# EAGLE design 2_power_a (EAGLE 6.4)
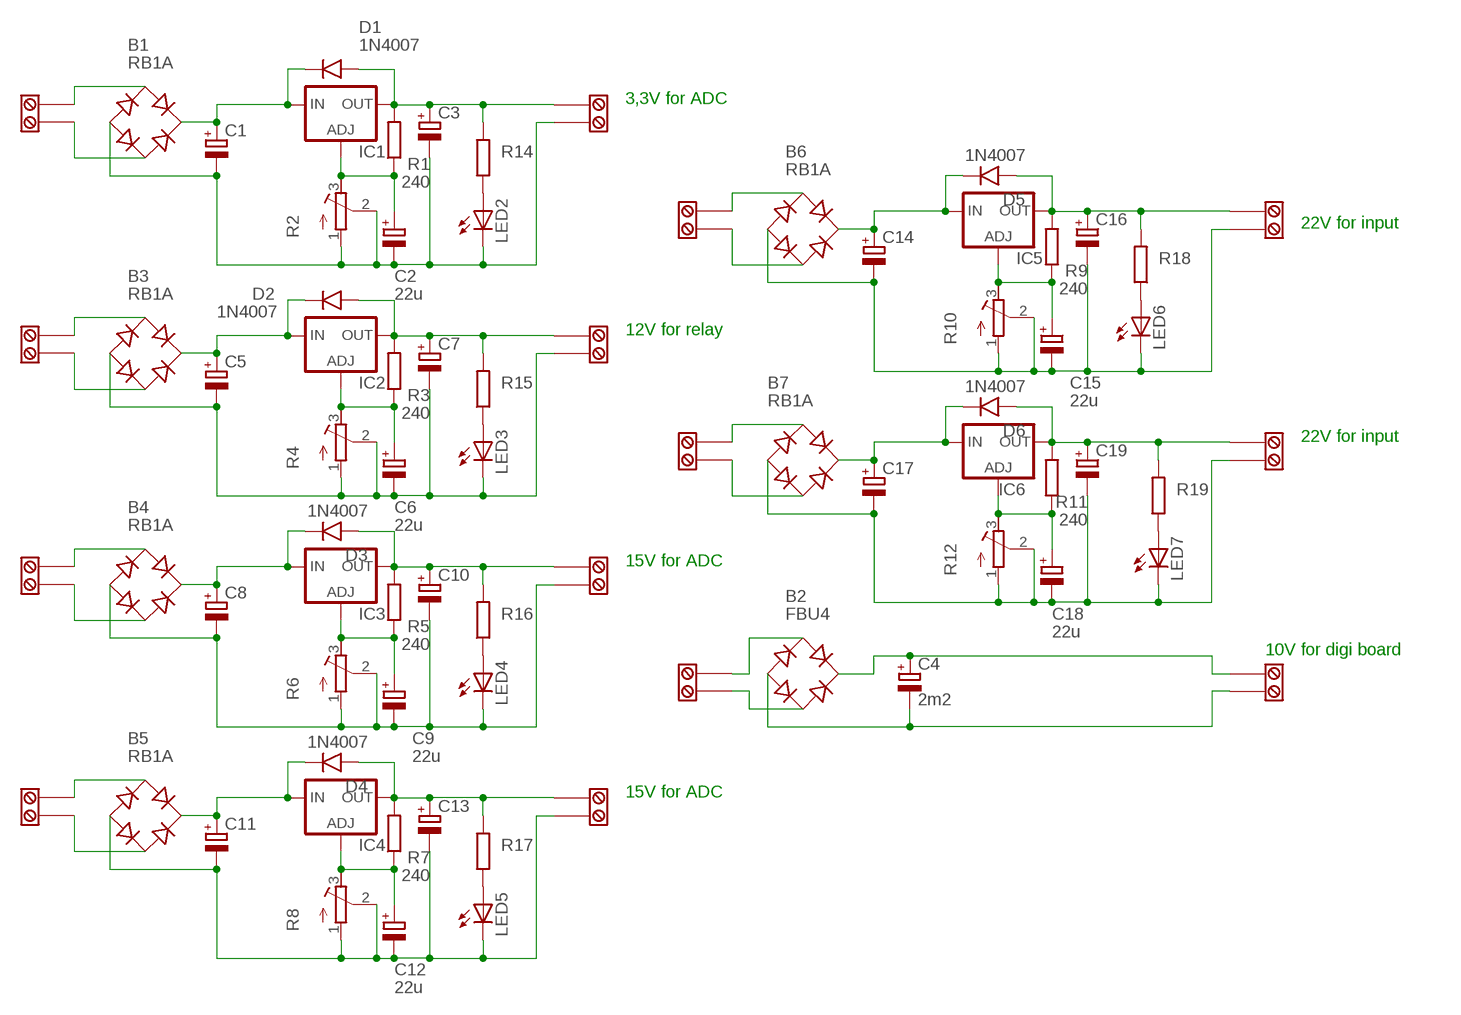
[diagram p0: schematic, sheet 1]

## Parts
B1  RB1A  RECTIFIER-RB1A  [RB1A]
B2  FBU4  RECTIFIER-FBU4  [FBU4]
B3  RB1A  RECTIFIER-RB1A  [RB1A]
B4  RB1A  RECTIFIER-RB1A  [RB1A]
B5  RB1A  RECTIFIER-RB1A  [RB1A]
B6  RB1A  RECTIFIER-RB1A  [RB1A]
B7  RB1A  RECTIFIER-RB1A  [RB1A]
C1  CPOL-EUE5-10.5  [E5-10,5]
C2  22u  CPOL-EUE2.5-6  [E2,5-6]
C3  CPOL-EUE3.5-8  [E3,5-8]
C4  2m2  CPOL-EUE5-13  [E5-13]
C5  CPOL-EUE5-10.5  [E5-10,5]
C6  22u  CPOL-EUE2.5-6  [E2,5-6]
C7  CPOL-EUE3.5-8  [E3,5-8]
C8  CPOL-EUE5-10.5  [E5-10,5]
C9  22u  CPOL-EUE2.5-6  [E2,5-6]
C10  CPOL-EUE3.5-8  [E3,5-8]
C11  CPOL-EUE5-10.5  [E5-10,5]
C12  22u  CPOL-EUE2.5-6  [E2,5-6]
C13  CPOL-EUE3.5-8  [E3,5-8]
C14  CPOL-EUE5-10.5  [E5-10,5]
C15  22u  CPOL-EUE2.5-6  [E2,5-6]
C16  CPOL-EUE3.5-8  [E3,5-8]
C17  CPOL-EUE5-10.5  [E5-10,5]
C18  22u  CPOL-EUE2.5-6  [E2,5-6]
C19  CPOL-EUE3.5-8  [E3,5-8]
D1  1N4007  [DO41]
D2  1N4007  [DO41]
D3  1N4007  [DO41]
D4  1N4007  [DO41]
D5  1N4007  [DO41]
D6  1N4007  [DO41]
IC1  LM317TS  [317TS]
IC2  LM317TS  [317TS]
IC3  LM317TS  [317TS]
IC4  LM317TS  [317TS]
IC5  LM317TS  [317TS]
IC6  LM317TS  [317TS]
LED2  LED3MM  [LED3MM]
LED3  LED3MM  [LED3MM]
LED4  LED3MM  [LED3MM]
LED5  LED3MM  [LED3MM]
LED6  LED3MM  [LED3MM]
LED7  LED3MM  [LED3MM]
R1  240  R191  [R_TR191]
R2  R-TRIMM64Y  [RTRIM64Y]
R3  240  R191  [R_TR191]
R4  R-TRIMM64Y  [RTRIM64Y]
R5  240  R191  [R_TR191]
R6  R-TRIMM64Y  [RTRIM64Y]
R7  240  R191  [R_TR191]
R8  R-TRIMM64Y  [RTRIM64Y]
R9  240  R191  [R_TR191]
R10  R-TRIMM64Y  [RTRIM64Y]
R11  240  R191  [R_TR191]
R12  R-TRIMM64Y  [RTRIM64Y]
R14  R191S  [R_R191S]
R15  R191S  [R_R191S]
R16  R191S  [R_R191S]
R17  R191S  [R_R191S]
R18  R191S  [R_R191S]
R19  R191S  [R_R191S]
U$1  TERM_2P_SBP  [TERM-2P_381_BP]
U$2  TERM_2P_SBP  [TERM-2P_381_BP]
U$3  TERM_2P_SBP  [TERM-2P_381_BP]
U$4  TERM_2P_SBP  [TERM-2P_381_BP]
U$5  TERM_2P_SBP  [TERM-2P_381_BP]
U$6  TERM_2P_SBP  [TERM-2P_381_BP]
U$7  TERM_2P_SBP  [TERM-2P_381_BP]
U$8  TERM_2P_SBP  [TERM-2P_381_BP]
U$9  TERM_2P_SBP  [TERM-2P_381_BP]
U$10  TERM_2P_SBP  [TERM-2P_381_BP]
U$11  TERM_2P_SBP  [TERM-2P_381_BP]
U$12  TERM_2P_SBP  [TERM-2P_381_BP]
U$13  TERM_2P_SBP  [TERM-2P_381_BP]
U$14  TERM_2P_SBP  [TERM-2P_381_BP]

## Nets
N$5: B1.AC1 U$2.P$1
N$6: B1.AC2 U$2.P$2
N$7: B1.+ C1.+ D1.K IC1.3(IN)
N$8: B1.- C1.- C2.- C3.- LED2.K(C) R2.1(E) R2.2(S) U$4.P$1
N$9: C3.+ D1.A IC1.2(OUT) R1.P$2 R14.P$2 U$4.P$2
N$10: C2.+ IC1.1(ADJ) R1.P$1 R2.3(A)
N$12: B2.AC1 U$1.P$1
N$13: B2.AC2 U$1.P$2
N$14: B2.- C4.- U$3.P$1
N$15: B2.+ C4.+ U$3.P$2
N$16: LED2.A R14.P$1
N$17: B3.AC1 U$5.P$1
N$18: B3.AC2 U$5.P$2
N$19: B3.+ C5.+ D2.K IC2.3(IN)
N$20: B3.- C5.- C6.- C7.- LED3.K(C) R4.1(E) R4.2(S) U$6.P$1
N$21: C7.+ D2.A IC2.2(OUT) R3.P$2 R15.P$2 U$6.P$2
N$22: C6.+ IC2.1(ADJ) R3.P$1 R4.3(A)
N$23: B4.AC1 U$7.P$1
N$24: B4.AC2 U$7.P$2
N$25: B4.+ C8.+ D3.K IC3.3(IN)
N$26: B4.- C8.- C9.- C10.- LED4.K(C) R6.1(E) R6.2(S) U$8.P$1
N$27: C10.+ D3.A IC3.2(OUT) R5.P$2 R16.P$2 U$8.P$2
N$28: C9.+ IC3.1(ADJ) R5.P$1 R6.3(A)
N$29: B5.AC1 U$9.P$1
N$30: B5.AC2 U$9.P$2
N$31: B5.+ C11.+ D4.K IC4.3(IN)
N$32: B5.- C11.- C12.- C13.- LED5.K(C) R8.1(E) R8.2(S) U$10.P$1
N$33: C13.+ D4.A IC4.2(OUT) R7.P$2 R17.P$2 U$10.P$2
N$34: C12.+ IC4.1(ADJ) R7.P$1 R8.3(A)
N$35: B6.AC1 U$11.P$1
N$36: B6.AC2 U$11.P$2
N$37: B6.+ C14.+ D5.K IC5.3(IN)
N$38: B6.- C14.- C15.- C16.- LED6.K(C) R10.1(E) R10.2(S) U$12.P$1
N$39: C16.+ D5.A IC5.2(OUT) R9.P$2 R18.P$2 U$12.P$2
N$40: C15.+ IC5.1(ADJ) R9.P$1 R10.3(A)
N$41: B7.AC1 U$13.P$1
N$42: B7.AC2 U$13.P$2
N$43: B7.+ C17.+ D6.K IC6.3(IN)
N$44: B7.- C17.- C18.- C19.- LED7.K(C) R12.1(E) R12.2(S) U$14.P$1
N$45: C19.+ D6.A IC6.2(OUT) R11.P$2 R19.P$2 U$14.P$2
N$46: C18.+ IC6.1(ADJ) R11.P$1 R12.3(A)
N$47: LED3.A R15.P$1
N$48: LED4.A R16.P$1
N$49: LED5.A R17.P$1
N$50: LED6.A R18.P$1
N$51: LED7.A R19.P$1

## Notes on the sheet
- 3,3V for ADC
- 22V for input
- 12V for relay
- 22V for input
- 15V for ADC
- 10V for digi board
- 15V for ADC

## Library data of the parts
B1-B7 = rectifier:RECTIFIER-: Rectifier
C1-C19 = _rcl:CPOL-EU: POLARIZED CAPACITOR, European symbol
D1-D6 = _mcom6:1N4007
IC1-IC6 = v-reg:LM317TS: VOLTAGE REGULATOR
LED2-LED7 = led:LED: LED OSRAM: - CHIPLED LG R971, LG N971, LY N971, LG Q971, LY Q971, LO R971, LY R971 LH N974, LH R974 LS Q976, LO Q976, LY Q976 LO Q996 - Hyper CHIPLED LW Q18S LB Q993, LB Q99A, LB R99A - SideLED LS A670, LO A670, LY A670, LG A670, LP A670 LB A673, LV A673, LT A673, LW A673 LH A674 LY A675 LS A676, LA A676, LO A676, LY A676, LW A676 LS A679, LY A679, LG A679 - Hyper Micro SIDELED® LS Y876, LA Y876, LO Y876, LY Y876 LT Y87S - SmartLED LW L88C, LW L88S LB L89C, LB L89S, LG L890 LS L89K, LO L89K, LY L89K LS L896, LA L896, LO L896, LY L896 - TOPLED LS T670, LO T670, LY T670, LG T670, LP T670 LSG T670, LSP T670, LSY T670, LOP T670, LYG T670 LG T671, LOG T671, LSG T671 LB T673, LV T673, LT T673, LW T673 LH T674 LS T676, LA T676, LO T676, LY T676, LB T676, LH T676, LSB T676, LW T676 LB T67C, LV T67C, LT T67C, LS T67K, LO T67K, LY T67K, LW E67C LS E67B, LA E67B, LO E67B, LY E67B, LB E67C, LV E67C, LT E67C LW T67C LS T679, LY T679, LG T679 LS T770, LO T770, LY T770, LG T770, LP T770 LB T773, LV T773, LT T773, LW T773 LH T774 LS E675, LA E675, LY E675, LS T675 LS T776, LA T776, LO T776, LY T776, LB T776 LHGB T686 LT T68C, LB T68C - Hyper Mini TOPLED® LB M676 - Mini TOPLED Santana® LG M470 LS M47K, LO M47K, LY M47K Source: http://www.osram.convergy.de LUXEON: - LUMILED® LXK2-PW12-R00, LXK2-PW12-S00, LXK2-PW14-U00, LXK2-PW14-V00 LXK2-PM12-R00, LXK2-PM12-S00, LXK2-PM14-U00 LXK2-PE12-Q00, LXK2-PE12-R00, LXK2-PE12-S00, LXK2-PE14-T00, LXK2-PE14-U00 LXK2-PB12-K00, LXK2-PB12-L00, LXK2-PB12-M00, LXK2-PB14-N00, LXK2-PB14-P00, LXK2-PB14-Q00 LXK2-PR12-L00, LXK2-PR12-M00, LXK2-PR14-Q00, LXK2-PR14-R00 LXK2-PD12-Q00, LXK2-PD12-R00, LXK2-PD12-S00 LXK2-PH12-R00, LXK2-PH12-S00 LXK2-PL12-P00, LXK2-PL12-Q00, LXK2-PL12-R00 Source: www.luxeon.com KINGBRIGHT: KA-3528ASYC Source: www.kingbright.com
R1 R3 R5 R7 R9 R11 R14-R19 = _moja:R
R2 R4 R6 R8 R10 R12 = _rcl:R-TRIMM: Trimm resistor
U$1-U$14 = _moja:TERM_2P_S

## Board
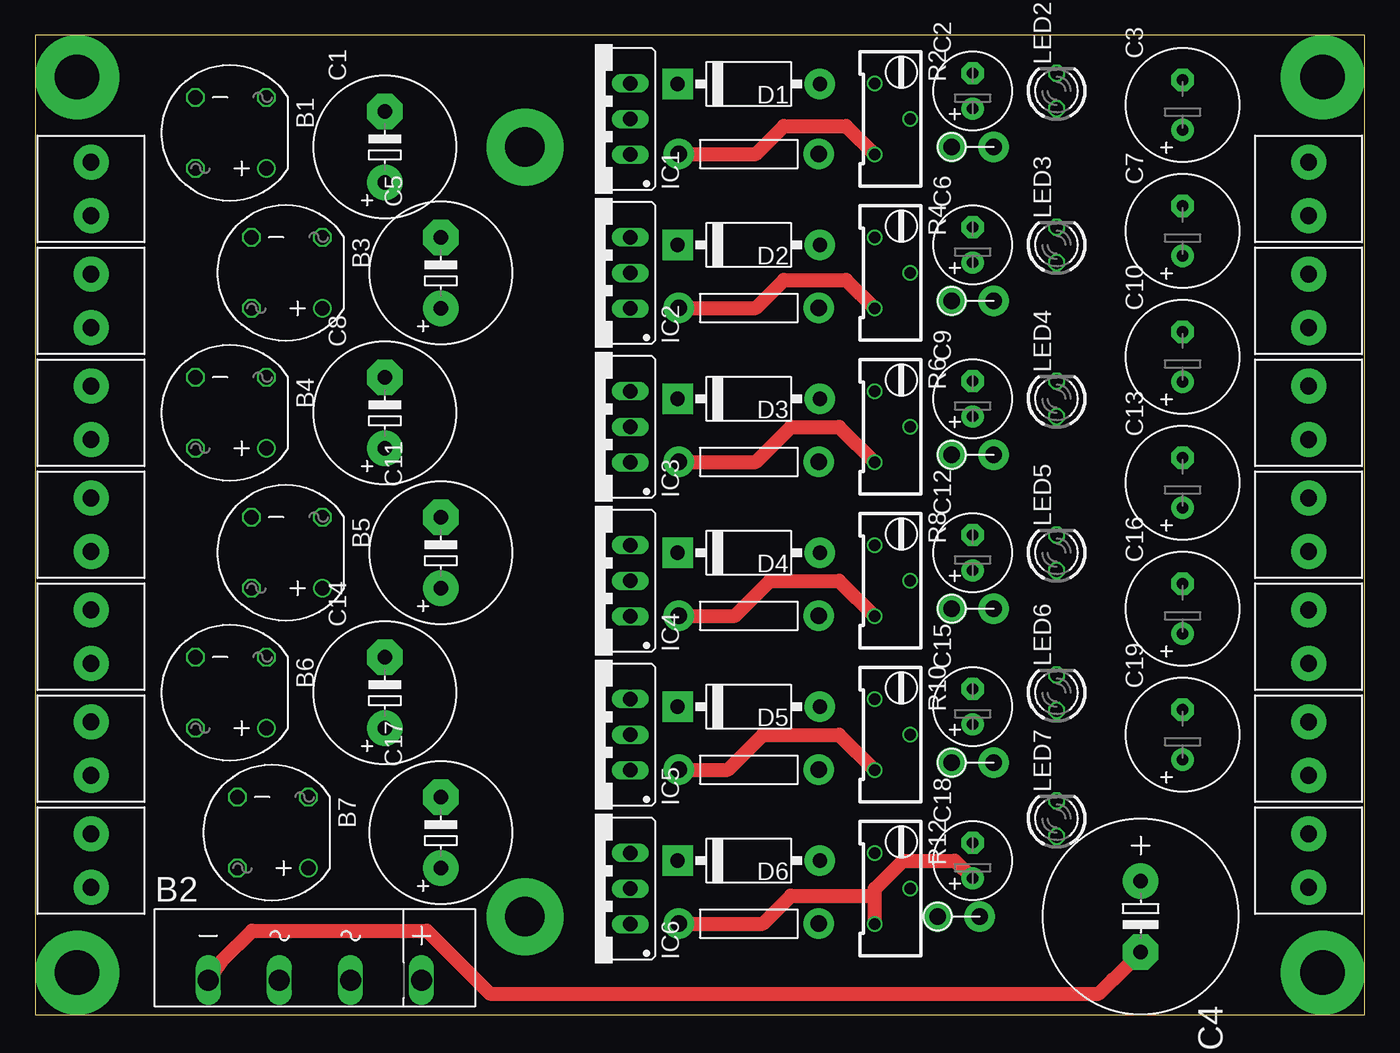
[diagram p1: board, top side]
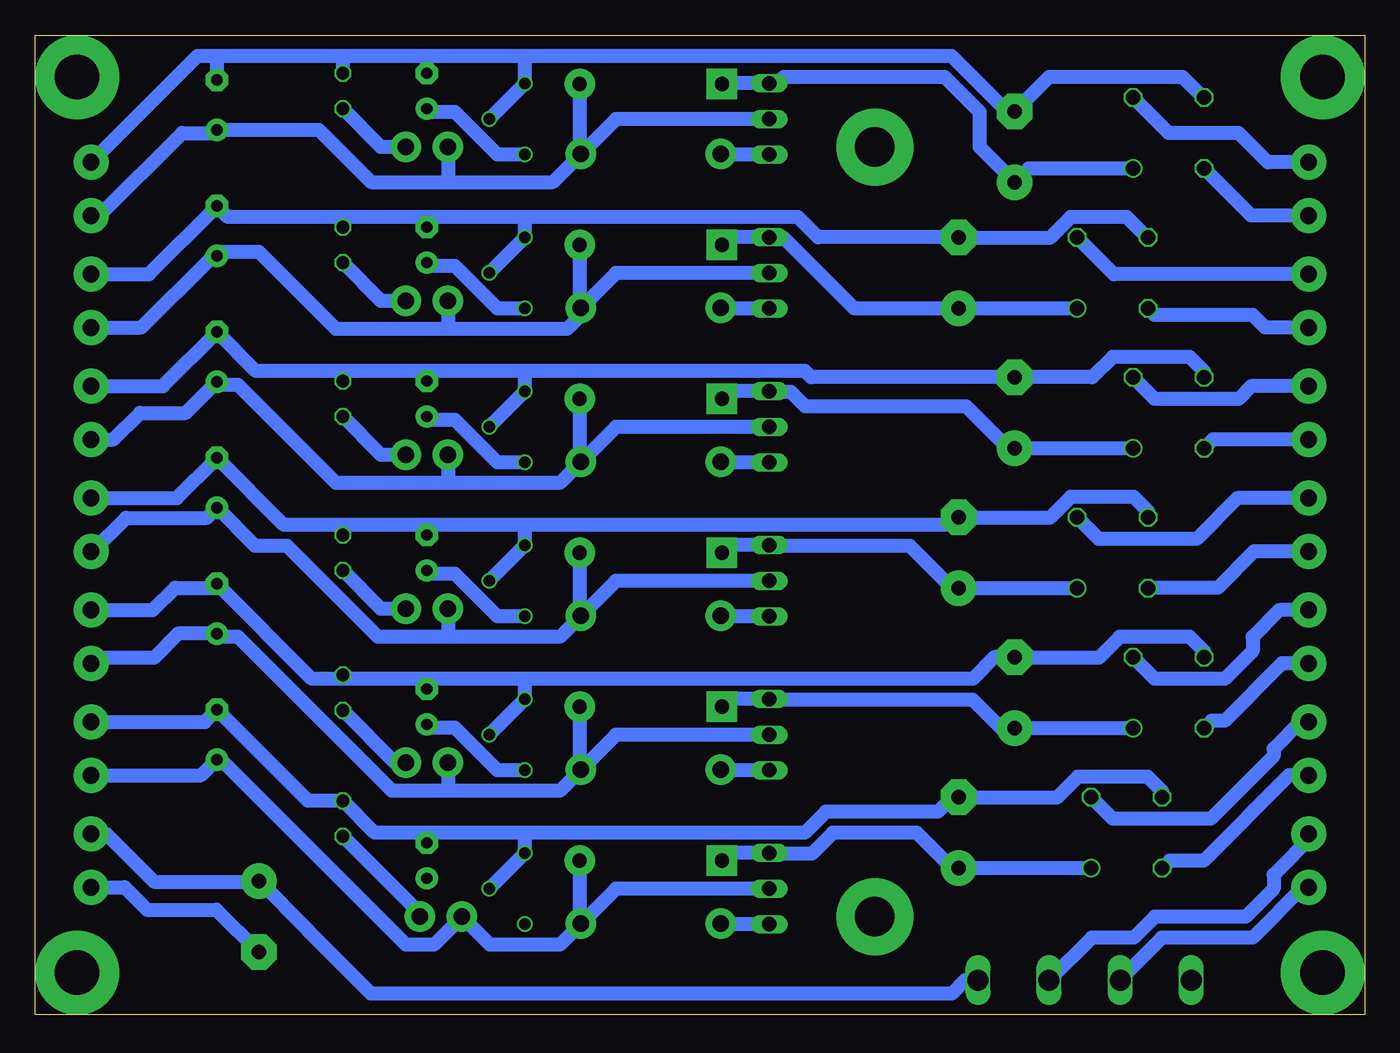
[diagram p2: board, bottom side, seen from below]

Size 95 x 70 mm. Coordinates in mm from the lower left corner, seen from the top.
Outline: 0,0 95,0 95,70 0,70 0,0
Copper layers (1*16): Top 0.035mm / dielectric 1.5mm / Bottom 0.035mm
Design rules "ch_6": minimum track width 0.15mm, minimum drill 0.4mm, track to track 0.2mm, track to pad 0.2mm, pad to pad 0.2mm, via to via 0.2mm, smd to smd 0.2mm, copper to edge 0.6mm, drill to drill 8mil, minimum pad ring 0.15mm, minimum via ring 0.15mm, stop-mask expansion 4mil, vias tented up to drill 0mil, thermal gap 10mil

### Footprints (pad centres in the part's own frame; a part is rotated, then mirrored left to right if it is on the bottom)
RB1A = drill 1.016: + -2.54,2.54 | drill 1.016 octagon: - 2.54,-2.54; AC1 2.54,2.54; AC2 -2.54,-2.54
FBU4 = drill 1.499 long: + 7.62,-1.54; - -7.62,-1.54; AC1 2.54,-1.54; AC2 -2.54,-1.54
E5-10,5 = drill 1.016 pad 2.54: + -2.54,0 | drill 1.016 pad 2.54 octagon: - 2.54,0
E2,5-6 = drill 0.813 pad 1.6: + -1.27,0 | drill 0.813 pad 1.6 octagon: - 1.27,0
E3,5-8 = drill 0.813 pad 1.6: + -1.778,0 | drill 0.813 pad 1.6 octagon: - 1.778,0
E5-13 = drill 1.016 pad 2.54: + -2.54,0 | drill 1.016 pad 2.54 octagon: - 2.54,0
DO41 = drill 1.016 pad 2.184: A -5.08,0 | drill 1.016 pad 2.184 square: K 5.08,0
317TS = drill 1.016 long: 1 -2.54,-2.54; 2 0,-2.54; 3 2.54,-2.54
LED3MM = drill 0.9 octagon: A -1.27,0; K 1.27,0
R_TR191 = drill 1.2 pad 2.2: P$1 5,0; P$2 -5,0
RTRIM64Y = drill 0.8: 1 0,-2.54; 2 -2.54,0; 3 0,2.54
R_R191S = drill 1.2 pad 2.2: P$1 -1.5,0; P$2 1.5,0
TERM-2P_381_BP = drill 1.2 pad 2.5: P$1 -1.905,0; P$2 1.905,0

### Placement (x,y rotation side)
B1  14,63 180 top
B2  20,4 0 top
B3  18,53 180 top
B4  14,43 180 top
B5  18,33 180 top
B6  14,23 180 top
B7  17,13 180 top
C1  25,62 90 top
C2  67,66 90 top
C3  82,65 90 top
C4  79,7 270 top
C5  29,53 90 top
C6  67,55 90 top
C7  82,56 90 top
C8  25,43 90 top
C9  67,44 90 top
C10  82,47 90 top
C11  29,33 90 top
C12  67,33 90 top
C13  82,38 90 top
C14  25,23 90 top
C15  67,22 90 top
C16  82,29 90 top
C17  29,13 90 top
C18  67,11 90 top
C19  82,20 90 top
D1  51,66.5 180 top
D2  51,55 180 top
D3  51,44 180 top
D4  51,33 180 top
D5  51,22 180 top
D6  51,11 180 top
IC1  40,64 90 top
IC2  40,53 90 top
IC3  40,42 90 top
IC4  40,31 90 top
IC5  40,20 90 top
IC6  40,9 90 top
LED2  73,66 90 top
LED3  73,55 90 top
LED4  73,44 90 top
LED5  73,33 90 top
LED6  73,23 90 top
LED7  73,14 90 top
R1  51,61.5 180 top
R2  60,64 180 top
R3  51,50.5 180 top
R4  60,53 180 top
R5  51,39.5 180 top
R6  60,42 180 top
R7  51,28.5 180 top
R8  60,31 180 top
R9  51,17.5 180 top
R10  60,20 180 top
R11  51,6.5 180 top
R12  60,9 180 top
R14  67,62 180 top
R15  67,51 180 top
R16  67,40 180 top
R17  67,29 180 top
R18  67,18 180 top
R19  66,7 180 top
U$1  4,11 270 top
U$2  4,59 90 top
U$3  91,11 90 top
U$4  91,59 270 top
U$5  4,51 90 top
U$6  91,51 270 top
U$7  4,43 90 top
U$8  91,43 270 top
U$9  4,35 90 top
U$10  91,35 270 top
U$11  4,27 90 top
U$12  91,27 270 top
U$13  4,19 90 top
U$14  91,19 270 top

### Tracks (layer width: path | path; a pad name or v marks a point on that pad's centre or on a via)
N$1  (via drill 3.2 pad 6)
  other vias: 3,3
N$2  (via drill 3.2 pad 6)
  other vias: 3,67
N$3  (via drill 3.2 pad 6)
  other vias: 92,67
N$4  (via drill 3.2 pad 6)
  other vias: 92,3
N$5
  Bottom 1: U$2.P$1 8.1,57.09 B1.AC1
N$6
  Bottom 1: U$2.P$2 6.91,60.91 9,63 14,63 B1.AC2
N$7
  Bottom 1: B1.+ 24,60.46 C1.+ 24.96,59.46 27.5,62 27.5,64.5 30,67 41.5,67 42,66.5 42.5,66.5 IC1.3 45.88,66.54 D1.K
N$8
  Bottom 1: B1.- 11.54,65.54 13,67 22.54,67 C1.- 25.54,64.54 29.5,68.5 60,68.5 | 60,68.5 67,68.5 | 67,68.5 73,68.5 | 73,68.5 82,68.5 | 82,68.5 83.41,68.5 U$4.P$1 | C3.- 82,68.5 | LED2.K 73,68.5 | C2.- 67,68.5 | 60,68.5 R2.1 R2.2
N$9
  Bottom 1: IC1.2 53.5,64 R1.P$2 | D1.A 56.08,61.58 R1.P$2 | 65.5,59.5 71,59.5 74.72,63.22 C3.+ 82.22,63 84.5,63 90.41,57.09 U$4.P$2 | 65.5,59.5 58,59.5 R1.P$2 | R14.P$2 65.5,59.5
N$10
  Top 1: R1.P$1 51.5,61.5 53.5,63.5 57.96,63.5 R2.3
  Bottom 1: IC1.1 45.96,61.46 R1.P$1 | R2.3 61.96,61.46 65,64.5 66.77,64.5 C2.+
N$11  (via drill 2.8 pad 5.5)
  other vias: 35,62
N$12
  Bottom 1: U$1.P$1 3.6,12.9 6.5,10 6.5,9 8.5,7 15,7 16.5,5.5 19.5,5.5 B2.AC1
N$13
  Bottom 1: U$1.P$2 4.41,9.1 8,5.5 14.5,5.5 17.5,2.5 B2.AC2
N$14
  Top 1: B2.- 13.38,3.88 15.5,6 28,6 32.5,1.5 76,1.5 77,2.5 77.04,2.5 C4.-
  Bottom 1: U$3.P$1 88.59,9.1 87,7.5 82.04,7.5 C4.-
N$15
  Bottom 1: B2.+ 28.54,2.46 29.5,1.5 71,1.5 75.5,6 75.46,6 C4.+ 79.04,9.5 86.5,9.5 89.91,12.9 U$3.P$2
N$16
  Bottom 1: R14.P$1 70.27,62 LED2.A
N$17
  Bottom 1: U$5.P$1 7.09,49.09 8,50 15,50 B3.AC1
N$18
  Bottom 1: U$5.P$2 17.91,52.91 B3.AC2
N$19
  Bottom 1: B3.+ C5.+ 36.46,50.46 41.5,55.5 42.5,55.5 IC2.3 45.38,55.54 D2.K
N$20
  Bottom 1: B3.- 15.54,55.54 17,57 21,57 22.5,55.5 28.96,55.5 C5.- 39.04,55.54 40.5,57 60,57 | 60,57 67,57 | 67,57 73,57 | 73,57 81.22,57 C7.- 86.87,52.91 U$6.P$1 | LED3.K 73,57 | C6.- 67,57 | 60,57 R4.1 R4.2
N$21
  Bottom 1: IC2.2 53.5,53 R3.P$2 | R3.P$2 56,50 57,49 65.5,49 | 65.5,49 73.5,49 79,54.5 81.72,54.5 C7.+ 82.22,54 82.5,54 87.41,49.09 U$6.P$2 | R15.P$2 65.5,49 | D2.A 56.08,50.58 R3.P$2
N$22
  Top 1: R3.P$1 51.5,50.5 53.5,52.5 57.96,52.5 R4.3
  Bottom 1: R4.3 61.96,50.46 65,53.5 66.77,53.5 C6.+ | IC2.1 45.96,50.46 R3.P$1
N$23
  Bottom 1: U$7.P$1 10.82,41.09 B4.AC1
N$24
  Bottom 1: U$7.P$2 8.1,44.91 9,44 15,44 B4.AC2
N$25
  Bottom 1: B4.+ C8.+ 26,41 28.46,43.46 39.96,43.46 41,44.5 42.5,44.5 IC3.3 44.96,44.54 45.5,44 D3.K
N$26
  Bottom 1: B4.- 11.46,45.96 12.5,47 18,47 19.46,45.54 C8.- 39.54,45.54 40,46 60,46 | 60,46 67,46 | 67,46 73,46 | 73,46 79.22,46 C10.- 85.87,44.91 U$8.P$1 | LED4.K 73,46 | C9.- 67,46 | 60,46 R6.1 R6.2
N$27
  Bottom 1: IC3.2 53.5,42 R5.P$2 | R5.P$2 57.5,38 65.5,38 | 65.5,38 73.5,38 80.5,45 81.78,45 C10.+ 84.22,43 87.5,43 89.41,41.09 U$8.P$2 | R16.P$2 65.5,38 | D3.A 56.08,39.58 R5.P$2
N$28
  Top 1: R5.P$1 51.5,39.5 54,42 57.46,42 R6.3
  Bottom 1: R6.3 61.96,39.46 65,42.5 66.77,42.5 C9.+ | IC3.1 45.96,39.46 R5.P$1
N$29
  Bottom 1: U$9.P$1 7.91,33.09 10.5,30.5 15.42,30.5 B5.AC1
N$30
  Bottom 1: U$9.P$2 9.1,36.91 12,34 19,34 B5.AC2
N$31
  Bottom 1: B5.+ C11.+ 29.46,30.46 32.5,33.5 42.5,33.5 IC4.3 45.38,33.54 D4.K
N$32
  Bottom 1: B5.- 15.46,35.96 16.5,37 21,37 22.5,35.5 28.96,35.5 C11.- 29.46,35.54 30,35 60,35 | 60,35 67,35 | 67,35 73,35 | 73,35 77.22,35 C13.- 84.87,36.91 U$10.P$1 | LED5.K 73,35 | C12.- 67,35 | 60,35 R8.1 R8.2
N$33
  Bottom 1: IC4.2 53.5,31 R7.P$2 | R7.P$2 57.5,27 65.5,27 | 65.5,27 70.5,27 77,33.5 79.28,33.5 C13.+ 82.72,35.5 88.5,35.5 90.91,33.09 U$10.P$2 | D4.A 56.08,28.58 R7.P$2 | R17.P$2 65.5,27
N$34
  Top 1: R7.P$1 50,28.5 52.5,31 57.46,31 R8.3
  Bottom 1: R8.3 61.96,28.46 65,31.5 66.77,31.5 C12.+ | IC4.1 45.96,28.46 R7.P$1
N$35
  Bottom 1: U$11.P$1 5.91,25.09 10,21 10.92,21 B6.AC1
N$36
  Bottom 1: U$11.P$2 6.09,28.91 8,27 8,26 10,24 15,24 B6.AC2
N$37
  Bottom 1: B6.+ C14.+ 25.96,20.46 28,22.5 42.5,22.5 IC5.3 45.38,22.54 D5.K
N$38
  Bottom 1: B6.- 11.46,25.96 12.5,27 17.5,27 19,25.5 24.96,25.5 C14.- 26.46,25.54 28,24 60,24 | 60,24 67,24 | 67,24 73,24 | 73,24 75.22,24 C16.- 82.28,30.5 85,30.5 86.59,28.91 U$12.P$1 | 60,24 R10.1 R10.2 | C15.- 67,24 | LED6.K 73,24
N$39
  Bottom 1: IC5.2 53.5,20 R9.P$2 | R9.P$2 57.5,16 65.5,16 | 65.5,16 69.5,16 80.5,27 81.78,27 C16.+ 84.78,27.22 86.5,25.5 90.59,25.5 U$12.P$2 | D5.A 56.08,17.58 R9.P$2 | R18.P$2 65.5,16
N$40
  Top 1: R9.P$1 49.5,17.5 52,20 57.46,20 R10.3
  Bottom 1: R10.3 61.96,17.46 65,20.5 66.77,20.5 C15.+ | IC5.1 45.96,17.46 R9.P$1
N$41
  Bottom 1: U$13.P$1 5.41,17.09 11.5,11 13.92,11 B7.AC1
N$42
  Bottom 1: U$13.P$2 4.59,20.91 6.5,19 6.5,18.5 11,14 18,14 B7.AC2
N$43
  Bottom 1: B7.+ C17.+ 29.46,10.46 32,13 38,13 39.5,11.5 42.5,11.5 IC6.3 45.38,11.54 D6.K
N$44
  Bottom 1: B7.- 14.46,15.96 15.5,17 20.5,17 22,15.5 28.96,15.5 C17.- 29.46,15.54 30.5,14.5 38.5,14.5 40,13 60,13 | 60,13 67,13 | 67,13 70.73,13 LED7.K 75.49,15.27 C19.- 82.87,20.91 U$14.P$1 | 60,13 R12.1 R12.2 | C18.- 67,13
N$45
  Bottom 1: U$14.P$2 83.13,17.09 C19.+ 81.78,18 81.5,18 68.5,5 66.5,5 R19.P$2 62.5,5 57.5,5 R11.P$2 | IC6.2 53.5,9 R11.P$2 | D6.A 56.08,6.58 R11.P$2
N$46
  Top 1: R12.3 60,8.5 | 60,8.5 60,9 62,11 65.73,11 C18.+ | R11.P$1 52,6.5 54,8.5 60,8.5
  Bottom 1: R11.P$1 42.58,6.5 IC6.1
N$47
  Bottom 1: R15.P$1 70.27,51 LED3.A
N$48
  Bottom 1: R16.P$1 70.27,40 LED4.A
N$49
  Bottom 1: R17.P$1 70.27,29 LED5.A
N$50
  Bottom 1: R18.P$1 69.27,18 LED6.A
N$51
  Bottom 1: R19.P$1 67.5,7.23 LED7.A
N$52  (via drill 2.8 pad 5.5)
  other vias: 35,7